# Altium schematic sheet QueenB-Schematic.SchDoc: QueenB
size A1; DrawnBy: PHIL SALMONY; Revision: A; SheetNumber: 1; SheetTotal: 1
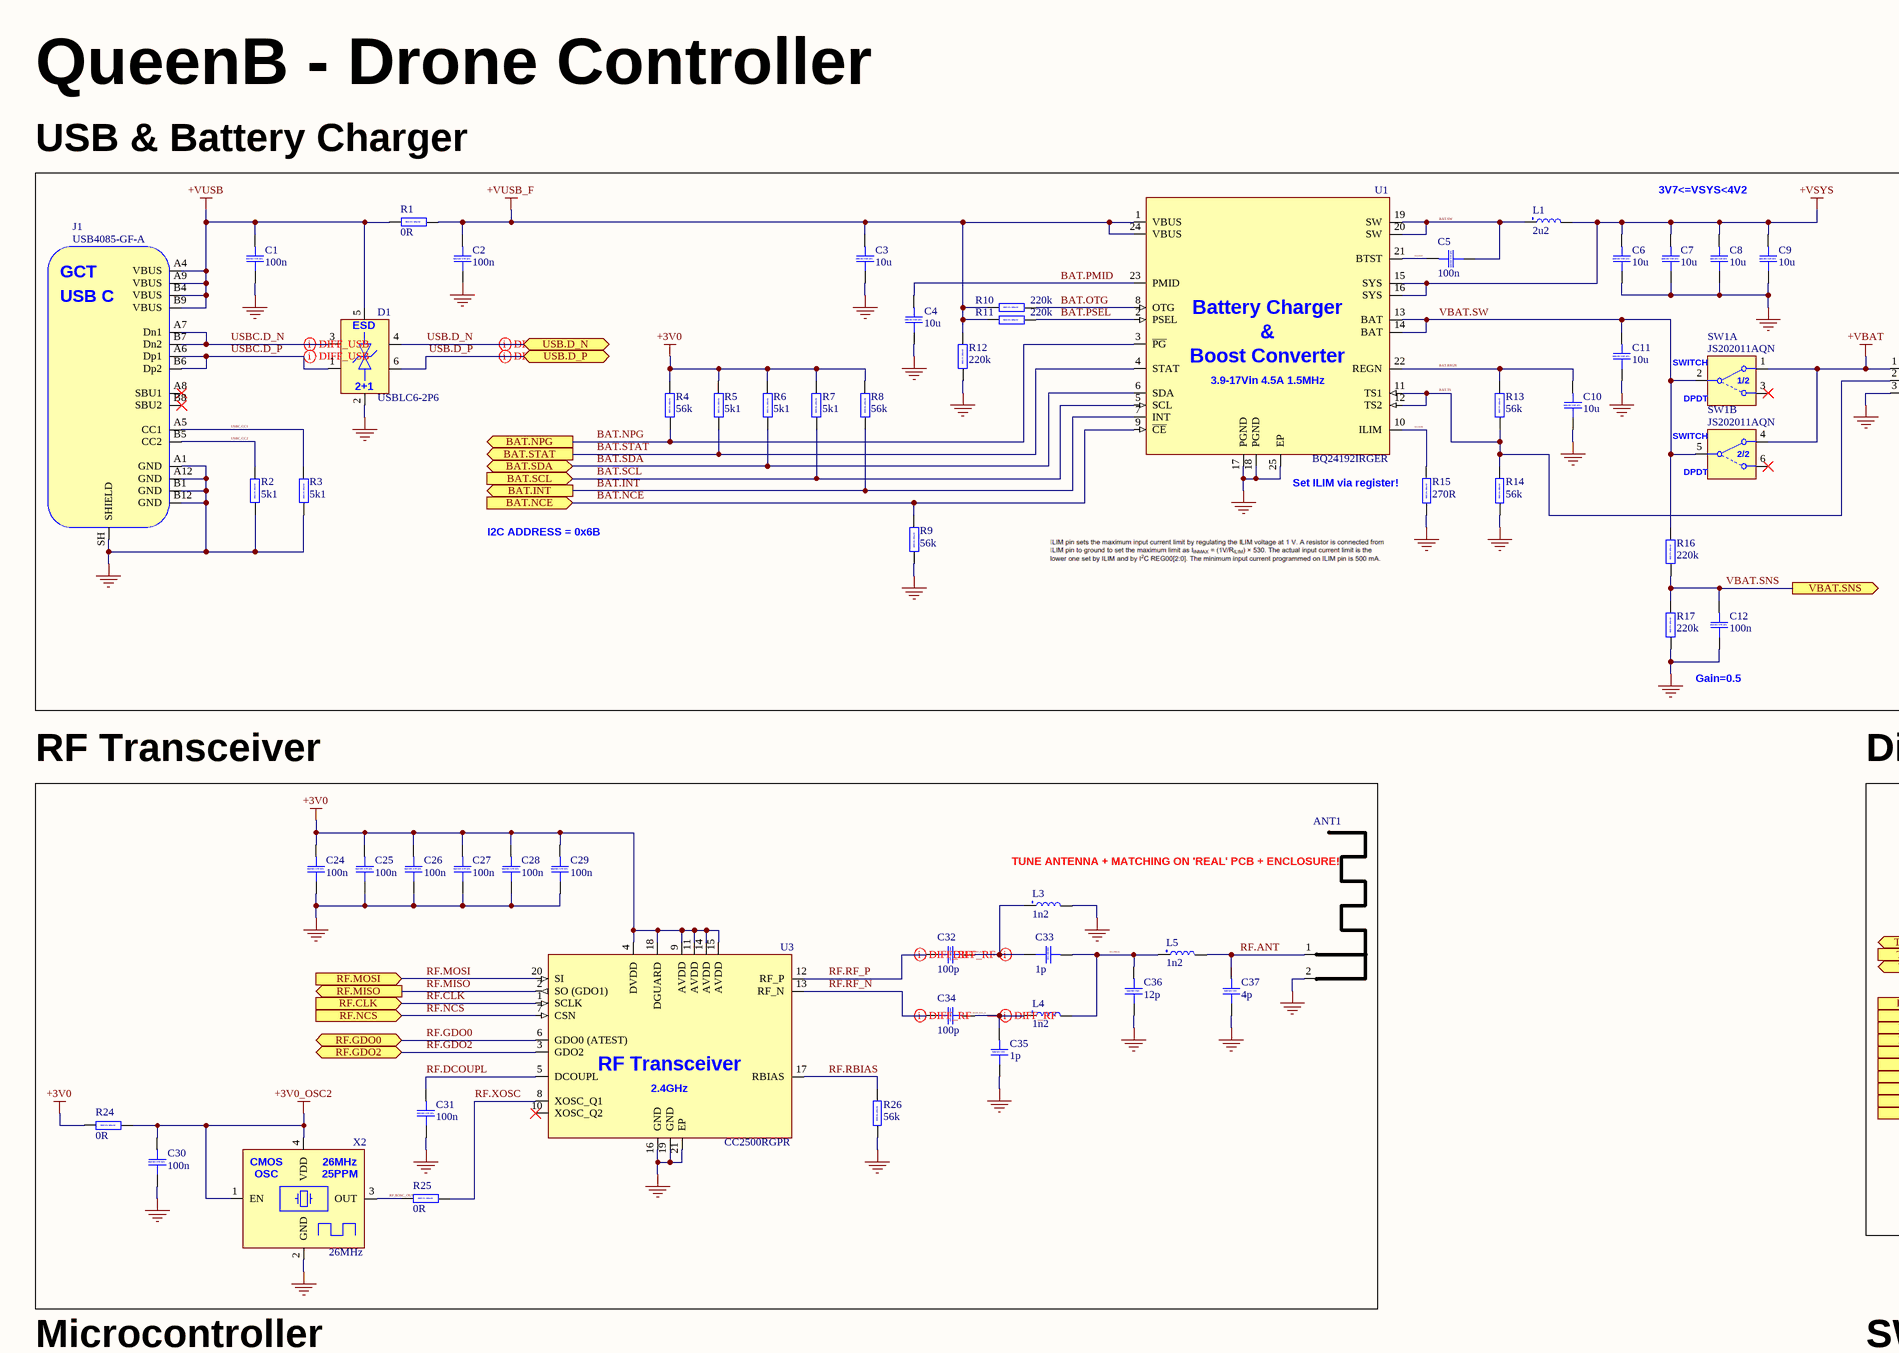
[diagram p0: QueenB-Schematic.SchDoc, top left]
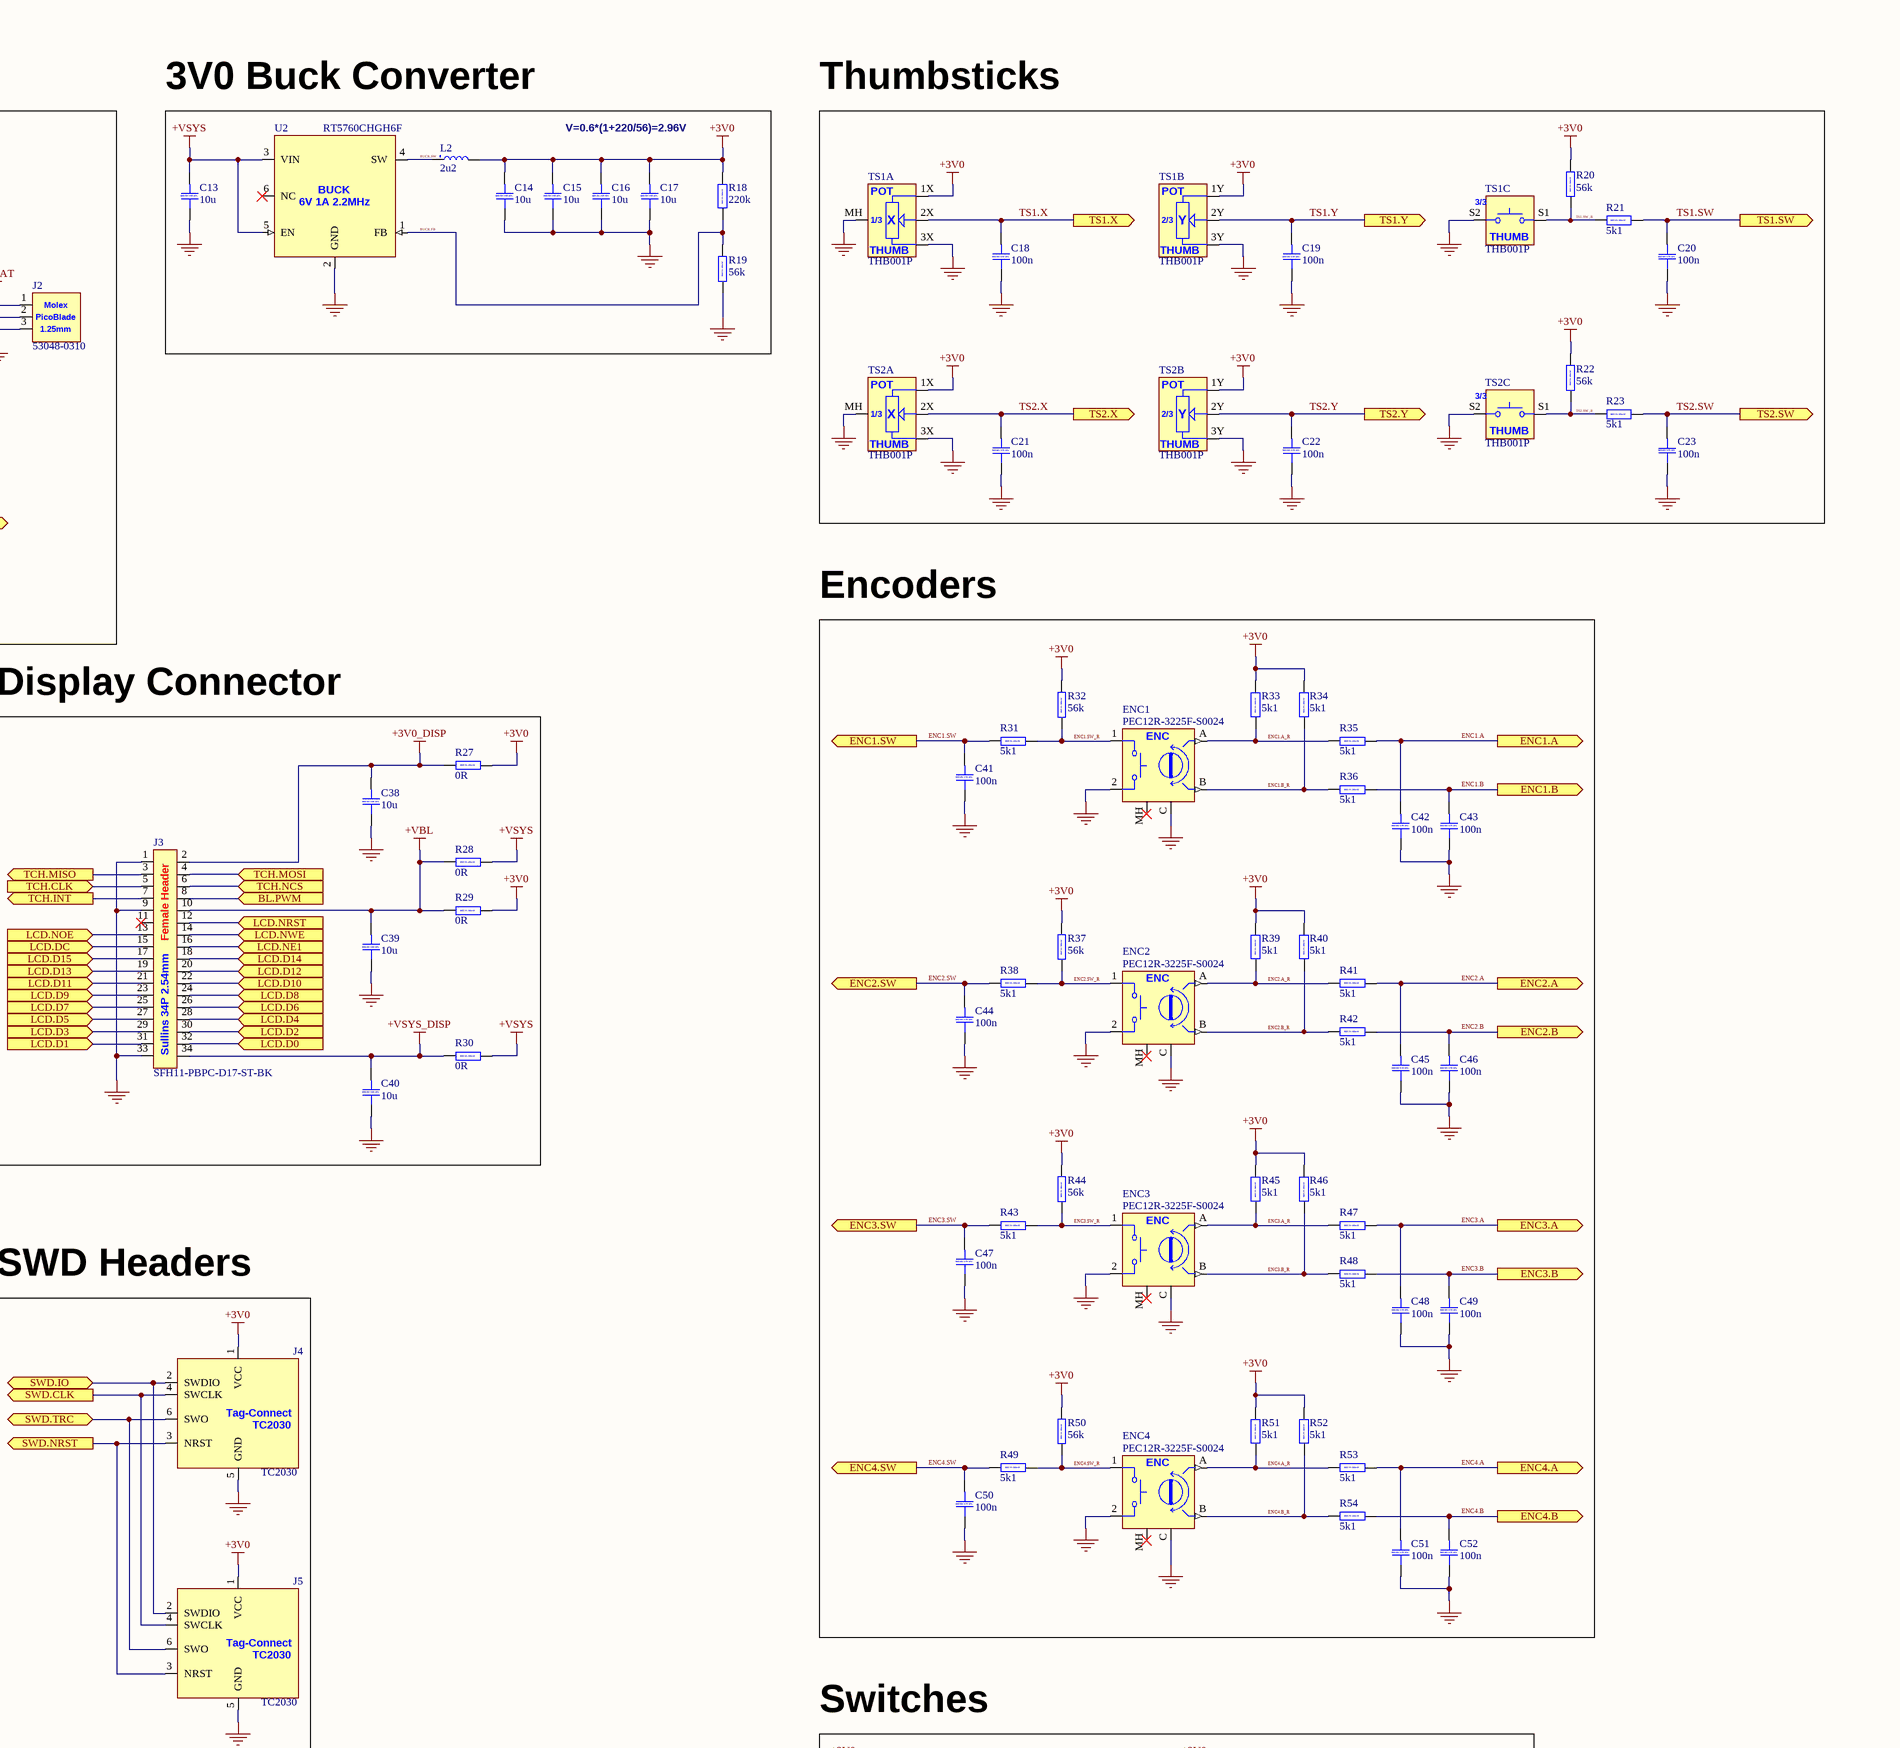
[diagram p1: QueenB-Schematic.SchDoc, top right]
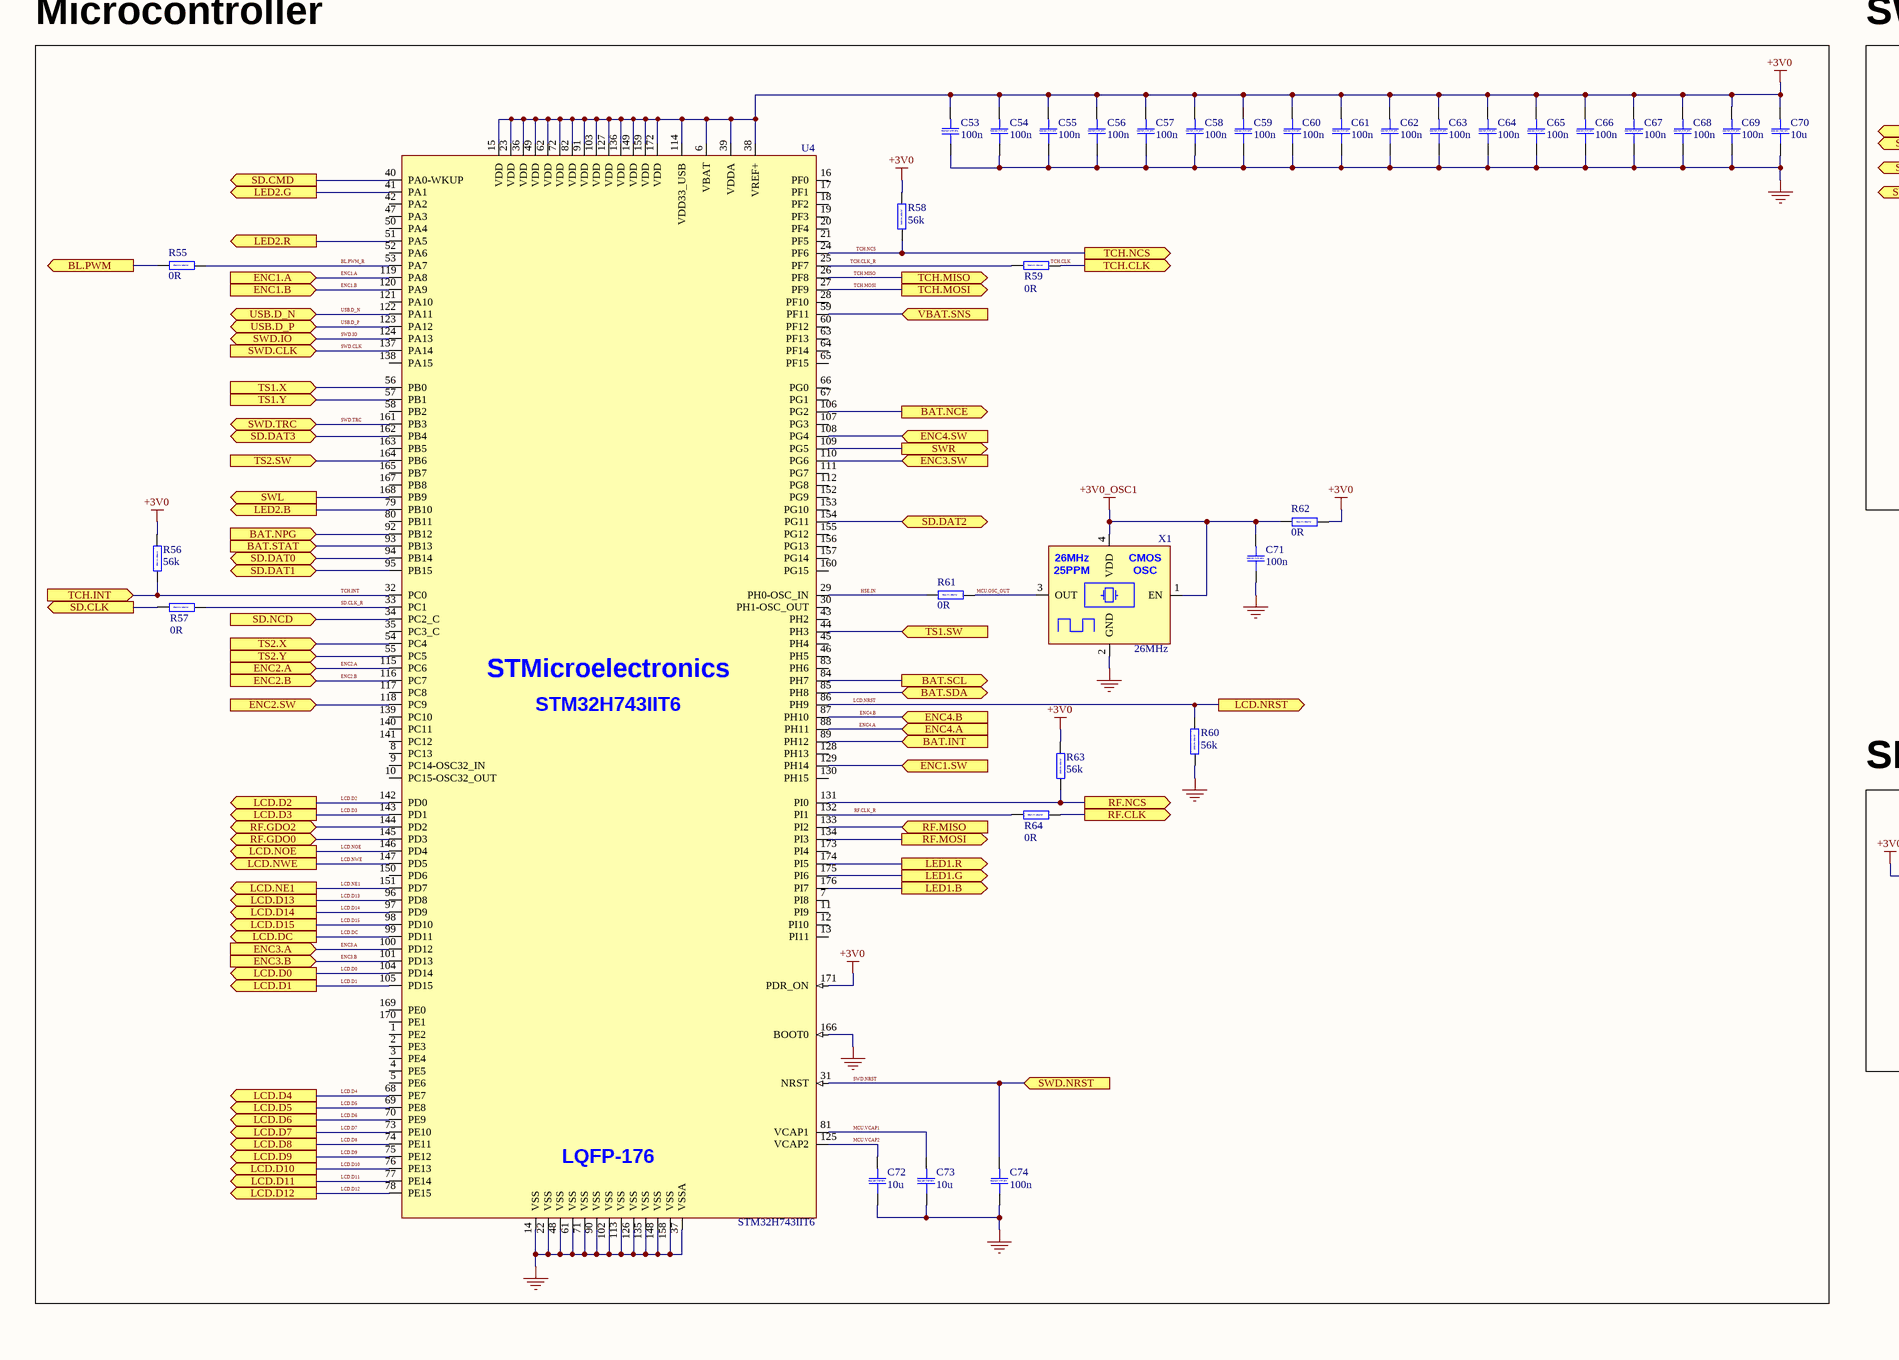
[diagram p2: QueenB-Schematic.SchDoc, bottom left]
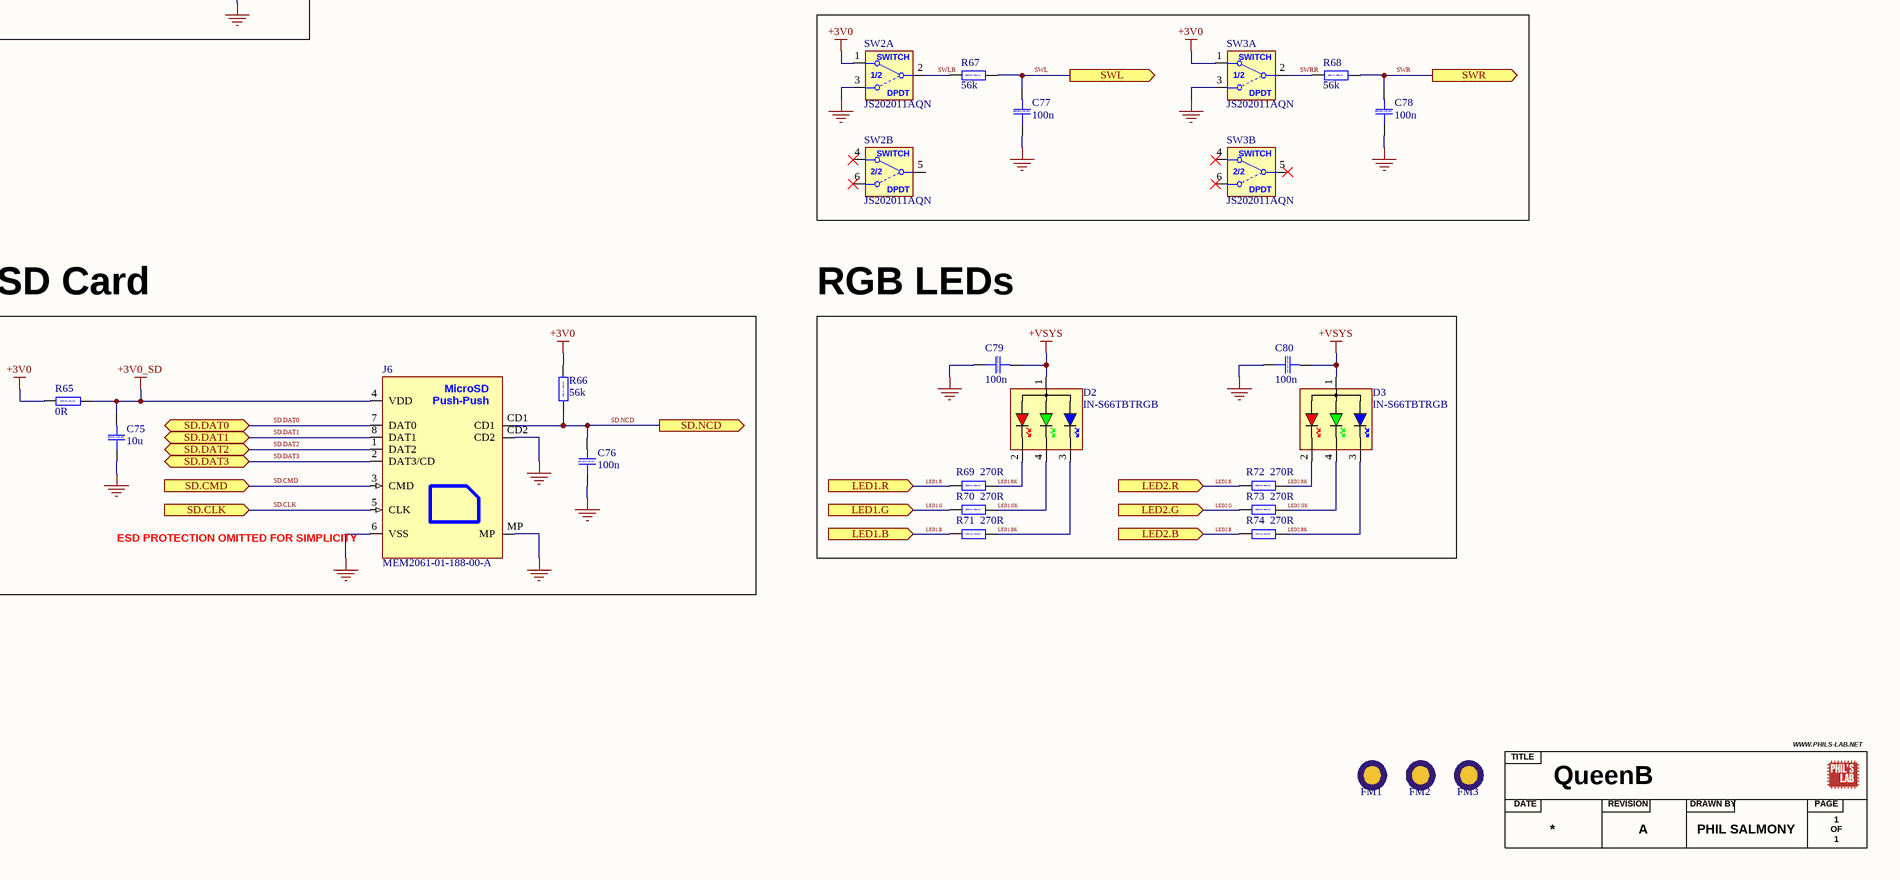
[diagram p3: QueenB-Schematic.SchDoc, bottom right]

## Parts
ANT1  PCB Antenna 2.4GHz 50Ohm  [ANT_IFA_USB_2_4GHZ_50R]  (value not drawn)  (no BOM)
C1  100n  [CAP_0603]
C2  100n  [CAP_0603]
C3  10u  [CAP_0805]
C4  10u  [CAP_0805]
C5  100n  [CAP_0603]
C6  10u  [CAP_0805]
C7  10u  [CAP_0805]
C8  10u  [CAP_0805]
C9  10u  [CAP_0805]
C10  10u  [CAP_0805]
C11  10u  [CAP_0805]
C12  100n  [CAP_0603]
C13  10u  [CAP_0805]
C14  10u  [CAP_0805]
C15  10u  [CAP_0805]
C16  10u  [CAP_0805]
C17  10u  [CAP_0805]
C18  100n  [CAP_0603]
C19  100n  [CAP_0603]
C20  100n  [CAP_0603]
C21  100n  [CAP_0603]
C22  100n  [CAP_0603]
C23  100n  [CAP_0603]
C24  100n  [CAP_0603]
C25  100n  [CAP_0603]
C26  100n  [CAP_0603]
C27  100n  [CAP_0603]
C28  100n  [CAP_0603]
C29  100n  [CAP_0603]
C30  100n  [CAP_0603]
C31  100n  [CAP_0603]
C32  100p  [CAP_0402]
C33  1p  [CAP_0402]
C34  100p  [CAP_0402]
C35  1p  [CAP_0402]
C36  12p  [CAP_0402]
C37  4p  [CAP_0402]
C38  10u  [CAP_0805]
C39  10u  [CAP_0805]
C40  10u  [CAP_0805]
C41  100n  [CAP_0603]
C42  100n  [CAP_0603]
C43  100n  [CAP_0603]
C44  100n  [CAP_0603]
C45  100n  [CAP_0603]
C46  100n  [CAP_0603]
C47  100n  [CAP_0603]
C48  100n  [CAP_0603]
C49  100n  [CAP_0603]
C50  100n  [CAP_0603]
C51  100n  [CAP_0603]
C52  100n  [CAP_0603]
C53  100n  [CAP_0603]
C54  100n  [CAP_0603]
C55  100n  [CAP_0603]
C56  100n  [CAP_0603]
C57  100n  [CAP_0603]
C58  100n  [CAP_0603]
C59  100n  [CAP_0603]
C60  100n  [CAP_0603]
C61  100n  [CAP_0603]
C62  100n  [CAP_0603]
C63  100n  [CAP_0603]
C64  100n  [CAP_0603]
C65  100n  [CAP_0603]
C66  100n  [CAP_0603]
C67  100n  [CAP_0603]
C68  100n  [CAP_0603]
C69  100n  [CAP_0603]
C70  10u  [CAP_0805]
C71  100n  [CAP_0603]
C72  10u  [CAP_0603]
C73  10u  [CAP_0603]
C74  100n  [CAP_0603]
C75  10u  [CAP_0805]
C76  100n  [CAP_0603]
C77  100n  [CAP_0603]
C78  100n  [CAP_0603]
C79  100n  [CAP_0603]
C80  100n  [CAP_0603]
D1  USBLC6-2P6  [SOT-666]
D2  IN-S66TBTRGB  [IN-S66TBTRGB]
D3  IN-S66TBTRGB  [IN-S66TBTRGB]
ENC1  PEC12R-3225F-S0024  [PEC12R-3225F-S]
ENC2  PEC12R-3225F-S0024  [PEC12R-3225F-S]
ENC3  PEC12R-3225F-S0024  [PEC12R-3225F-S]
ENC4  PEC12R-3225F-S0024  [PEC12R-3225F-S]
FM1  Fiducial Marker Round 1mm  [FIDUCIAL_MARKER_ROUND_1MM]  (value not drawn)  (no BOM)
FM2  Fiducial Marker Round 1mm  [FIDUCIAL_MARKER_ROUND_1MM]  (value not drawn)  (no BOM)
FM3  Fiducial Marker Round 1mm  [FIDUCIAL_MARKER_ROUND_1MM]  (value not drawn)  (no BOM)
J1  USB4085-GF-A  [USB4085-GF-A]
J2  53048-0310  [53048-0310]
J3  SFH11-PBPC-D17-ST-BK  [SFH11-PBPC-D17-ST-BK]
J4  TC2030  [TC2030]  (no BOM)
J5  TC2030  [TC2030]  (no BOM)
J6  MEM2061-01-188-00-A  [MEM2061-01-188-00-A]
L1  2u2  [XAL4020]
L2  2u2  [XAL4020]
L3  1n2  [IND_0402]
L4  1n2  [IND_0402]
L5  1n2  [IND_0402]
R1  0R  [RES_0603]
R2  5k1  [RES_0603]
R3  5k1  [RES_0603]
R4  56k  [RES_0603]
R5  5k1  [RES_0603]
R6  5k1  [RES_0603]
R7  5k1  [RES_0603]
R8  56k  [RES_0603]
R9  56k  [RES_0603]
R10  220k  [RES_0603]
R11  220k  [RES_0603]
R12  220k  [RES_0603]
R13  56k  [RES_0603]
R14  56k  [RES_0603]
R15  270R  [RES_0603]
R16  220k  [RES_0603]
R17  220k  [RES_0603]
R18  220k  [RES_0603]
R19  56k  [RES_0603]
R20  56k  [RES_0603]
R21  5k1  [RES_0603]
R22  56k  [RES_0603]
R23  5k1  [RES_0603]
R24  0R  [RES_0603]
R25  0R  [RES_0603]
R26  56k  [RES_0603]
R27  0R  [RES_0603]
R28  0R  [RES_0603]
R29  0R  [RES_0603]
R30  0R  [RES_0603]
R31  5k1  [RES_0603]
R32  56k  [RES_0603]
R33  5k1  [RES_0603]
R34  5k1  [RES_0603]
R35  5k1  [RES_0603]
R36  5k1  [RES_0603]
R37  56k  [RES_0603]
R38  5k1  [RES_0603]
R39  5k1  [RES_0603]
R40  5k1  [RES_0603]
R41  5k1  [RES_0603]
R42  5k1  [RES_0603]
R43  5k1  [RES_0603]
R44  56k  [RES_0603]
R45  5k1  [RES_0603]
R46  5k1  [RES_0603]
R47  5k1  [RES_0603]
R48  5k1  [RES_0603]
R49  5k1  [RES_0603]
R50  56k  [RES_0603]
R51  5k1  [RES_0603]
R52  5k1  [RES_0603]
R53  5k1  [RES_0603]
R54  5k1  [RES_0603]
R55  0R  [RES_0603]
R56  56k  [RES_0603]
R57  0R  [RES_0603]
R58  56k  [RES_0603]
R59  0R  [RES_0603]
R60  56k  [RES_0603]
R61  0R  [RES_0603]
R62  0R  [RES_0603]
R63  56k  [RES_0603]
R64  0R  [RES_0603]
R65  0R  [RES_0603]
R66  56k  [RES_0603]
R67  56k  [RES_0603]
R68  56k  [RES_0603]
R69  270R  [RES_0603]
R70  270R  [RES_0603]
R71  270R  [RES_0603]
R72  270R  [RES_0603]
R73  270R  [RES_0603]
R74  270R  [RES_0603]
SW1  JS202011AQN  [JS202011AQN]  (parts A,B of 2)
SW2  JS202011AQN  [JS202011AQN]  (parts A,B of 2)
SW3  JS202011AQN  [JS202011AQN]  (parts A,B of 2)
TB  Schematic Title Block Template  (value not drawn)  (graphical)
TS1  THB001P  [THB001P]  (parts A,B,C of 3)
TS2  THB001P  [THB001P]  (parts A,B,C of 3)
U1  BQ24192IRGER  [VQFN-24]
U2  RT5760CHGH6F  [SOT-563]
U3  CC2500RGPR  [QFN-20]
U4  STM32H743IIT6  [LQFP-176]
X1  26MHz  [XTAL_2520]
X2  26MHz  [XTAL_2520]

## Blocks framed on the sheet
USB & Battery Charger: C1-C12 D1 J1 J2 L1 R1-R17 SW1 U1
3V0 Buck Converter: C13-C17 L2 R18 R19 U2
Thumbsticks: C18-C23 R20-R23 TS1 TS2
Encoders: C41-C52 ENC1-ENC4 R31-R54
RF Transceiver: ANT1 C24-C37 L3-L5 R24-R26 U3 X2
Display Connector: C38-C40 J3 R27-R30
Microcontroller: C53-C74 R55-R64 U4 X1
SWD Headers: J4 J5
Switches: C77 C78 R67 R68 SW2 SW3
SD Card: C75 C76 J6 R65 R66
RGB LEDs: C79 C80 D2 D3 R69-R74

## Ports
BAT.INT (in, see QueenB-Schematic[2A]), BAT.INT (out, see QueenB-Schematic[3D]), BAT.NCE (in, see QueenB-Schematic[3C]), BAT.NCE (out, see QueenB-Schematic[2A]), BAT.NPG (in, see QueenB-Schematic[2A]), BAT.NPG (out, see QueenB-Schematic[1C]), BAT.SCL (in, see QueenB-Schematic[3C]), BAT.SCL (out, see QueenB-Schematic[2A]), BAT.SDA (bidir, see QueenB-Schematic[2A]), BAT.SDA (bidir, see QueenB-Schematic[3D]), BAT.STAT (in, see QueenB-Schematic[2A]), BAT.STAT (out, see QueenB-Schematic[1C]), BL.PWM (in, see QueenB-Schematic[1C]), BL.PWM (out, see QueenB-Schematic[7B]), ENC1.A (in, see QueenB-Schematic[11B]), ENC1.A (out, see QueenB-Schematic[1C]), ENC1.B (in, see QueenB-Schematic[11B]), ENC1.B (out, see QueenB-Schematic[1C]), ENC1.SW (in, see QueenB-Schematic[9B]), ENC1.SW (out, see QueenB-Schematic[3D]), ENC2.A (in, see QueenB-Schematic[11B]), ENC2.A (out, see QueenB-Schematic[1C]), ENC2.B (in, see QueenB-Schematic[11B]), ENC2.B (out, see QueenB-Schematic[1C]), ENC2.SW (in, see QueenB-Schematic[9B]), ENC2.SW (out, see QueenB-Schematic[1D]), ENC3.A (in, see QueenB-Schematic[11B]), ENC3.A (out, see QueenB-Schematic[1D]), ENC3.B (in, see QueenB-Schematic[11C]), ENC3.B (out, see QueenB-Schematic[1D]), ENC3.SW (in, see QueenB-Schematic[9B]), ENC3.SW (out, see QueenB-Schematic[3C]), ENC4.A (in, see QueenB-Schematic[11C]), ENC4.A (out, see QueenB-Schematic[3D]), ENC4.B (in, see QueenB-Schematic[11C]), ENC4.B (out, see QueenB-Schematic[3D]), ENC4.SW (in, see QueenB-Schematic[9C]), ENC4.SW (out, see QueenB-Schematic[3C]), LCD.D0 (in, see QueenB-Schematic[1D]), LCD.D0 (out, see QueenB-Schematic[7B]), LCD.D1 (in, see QueenB-Schematic[1D]), LCD.D1 (out, see QueenB-Schematic[7B]), LCD.D2 (in, see QueenB-Schematic[1D]), LCD.D2 (out, see QueenB-Schematic[7B]), LCD.D3 (in, see QueenB-Schematic[1D]), LCD.D3 (out, see QueenB-Schematic[7B]), LCD.D4 (in, see QueenB-Schematic[1D]), LCD.D4 (out, see QueenB-Schematic[7B]), LCD.D5 (in, see QueenB-Schematic[1D]), LCD.D5 (out, see QueenB-Schematic[7B]), LCD.D6 (in, see QueenB-Schematic[1D]), LCD.D6 (out, see QueenB-Schematic[7B]), LCD.D7 (in, see QueenB-Schematic[1D]), LCD.D7 (out, see QueenB-Schematic[7B]), LCD.D8 (in, see QueenB-Schematic[1D]), LCD.D8 (out, see QueenB-Schematic[7B]), LCD.D9 (in, see QueenB-Schematic[1D]), LCD.D9 (out, see QueenB-Schematic[7B]), LCD.D10 (in, see QueenB-Schematic[1D]), LCD.D10 (out, see QueenB-Schematic[7B]), LCD.D11 (in, see QueenB-Schematic[1D]), LCD.D11 (out, see QueenB-Schematic[7B]), LCD.D12 (in, see QueenB-Schematic[1D]), LCD.D12 (out, see QueenB-Schematic[7B]), LCD.D13 (in, see QueenB-Schematic[1D]), LCD.D13 (out, see QueenB-Schematic[7B]), LCD.D14 (in, see QueenB-Schematic[1D]), LCD.D14 (out, see QueenB-Schematic[7B]), LCD.D15 (in, see QueenB-Schematic[1D]), LCD.D15 (out, see QueenB-Schematic[7B]), LCD.DC (in, see QueenB-Schematic[1D]), LCD.DC (out, see QueenB-Schematic[7B]), LCD.NE1 (in, see QueenB-Schematic[1D]), LCD.NE1 (out, see QueenB-Schematic[7B]), LCD.NOE (in, see QueenB-Schematic[1D]), LCD.NOE (out, see QueenB-Schematic[7B]), LCD.NRST (in, see QueenB-Schematic[4D]), LCD.NRST (out, see QueenB-Schematic[7B]), LCD.NWE (in, see QueenB-Schematic[1D]), LCD.NWE (out, see QueenB-Schematic[7B]), LED1.B (in, see QueenB-Schematic[3D]), LED1.B (out, see QueenB-Schematic[9D]), LED1.G (in, see QueenB-Schematic[3D]), LED1.G (out, see QueenB-Schematic[9D]), LED1.R (in, see QueenB-Schematic[3D]), LED1.R (out, see QueenB-Schematic[9D]), LED2.B (in, see QueenB-Schematic[1C]), LED2.B (out, see QueenB-Schematic[10D]), LED2.G (in, see QueenB-Schematic[1C]), LED2.G (out, see QueenB-Schematic[10D]), LED2.R (in, see QueenB-Schematic[1C]), LED2.R (out, see QueenB-Schematic[10D]), RF.CLK (in, see QueenB-Schematic[4D]), RF.CLK (out, see QueenB-Schematic[2B]), RF.GDO0 (bidir, see QueenB-Schematic[1D]), RF.GDO0 (bidir, see QueenB-Schematic[2B]), RF.GDO2 (bidir, see QueenB-Schematic[1D]), RF.GDO2 (bidir, see QueenB-Schematic[2B]), RF.MISO (in, see QueenB-Schematic[2B]), RF.MISO (out, see QueenB-Schematic[3D]), RF.MOSI (in, see QueenB-Schematic[3D]), RF.MOSI (out, see QueenB-Schematic[2B]), RF.NCS (in, see QueenB-Schematic[4D]), RF.NCS (out, see QueenB-Schematic[2B]), SD.CLK (in, see QueenB-Schematic[1C]), SD.CLK (out, see QueenB-Schematic[7D]), SD.CMD (in, see QueenB-Schematic[1C]), SD.CMD (out, see QueenB-Schematic[7D]), SD.DAT0 (bidir, see QueenB-Schematic[1C]), SD.DAT0 (bidir, see QueenB-Schematic[7D]), SD.DAT1 (bidir, see QueenB-Schematic[1C]), SD.DAT1 (bidir, see QueenB-Schematic[7D]), SD.DAT2 (bidir, see QueenB-Schematic[3C]), SD.DAT2 (bidir, see QueenB-Schematic[7D]), SD.DAT3 (bidir, see QueenB-Schematic[1C]), SD.DAT3 (bidir, see QueenB-Schematic[7D]), SD.NCD (in, see QueenB-Schematic[9D]), SD.NCD (out, see QueenB-Schematic[1C]), SWD.CLK (in, see QueenB-Schematic[7C]), SWD.CLK (out, see QueenB-Schematic[1C]), SWD.IO (bidir, see QueenB-Schematic[1C]), SWD.IO (bidir, see QueenB-Schematic[7C]), SWD.NRST (in, see QueenB-Schematic[7C]), SWD.NRST (out, see QueenB-Schematic[4D]), SWD.TRC (bidir, see QueenB-Schematic[1C]), SWD.TRC (bidir, see QueenB-Schematic[7C]), SWL (out, see QueenB-Schematic[1C]), SWL (out, see QueenB-Schematic[10C]), SWR (out, see QueenB-Schematic[3C]), SWR (out, see QueenB-Schematic[11C]), TCH.CLK (in, see QueenB-Schematic[4C]), TCH.CLK (out, see QueenB-Schematic[7B]), TCH.INT (in, see QueenB-Schematic[7B]), TCH.INT (out, see QueenB-Schematic[1C]), TCH.MISO (out, see QueenB-Schematic[3C]), TCH.MISO (out, see QueenB-Schematic[7B]), TCH.MOSI (in, see QueenB-Schematic[3C]), TCH.MOSI (out, see QueenB-Schematic[7B]), TCH.NCS (in, see QueenB-Schematic[4C]), TCH.NCS (out, see QueenB-Schematic[7B]), TS1.SW (in, see QueenB-Schematic[12A]), TS1.SW (out, see QueenB-Schematic[3C]), TS1.X (in, see QueenB-Schematic[10A]), TS1.X (out, see QueenB-Schematic[1C]), TS1.Y (in, see QueenB-Schematic[11A]), TS1.Y (out, see QueenB-Schematic[1C]), TS2.SW (in, see QueenB-Schematic[12A]), TS2.SW (out, see QueenB-Schematic[1C]), TS2.X (in, see QueenB-Schematic[10A]), TS2.X (out, see QueenB-Schematic[1C]), TS2.Y (in, see QueenB-Schematic[11A]), TS2.Y (out, see QueenB-Schematic[1C]), USB.D_N (bidir, see QueenB-Schematic[1C]), USB.D_N (bidir, see QueenB-Schematic[2A]), USB.D_P (bidir, see QueenB-Schematic[1C]), USB.D_P (bidir, see QueenB-Schematic[2A]), VBAT.SNS (in, see QueenB-Schematic[6A]), VBAT.SNS (out, see QueenB-Schematic[3C])

## Nets
+3V0: C14.1 C15.1 C16.1 C17.1 C24.1 C25.1 C26.1 C27.1 C28.1 C29.1 C53.1 C54.1 C55.1 C56.1 C57.1 C58.1 C59.1 C60.1 C61.1 C62.1 C63.1 C64.1 C65.1 C66.1 C67.1 C68.1 C69.1 C70.1 J4.1(VCC) J5.1(VCC) L2.2 R4.2 R5.2 R6.2 R7.2 R8.2 R18.2 R20.2 R22.2 R24.1 R27.2 R29.2 R32.2 R33.2 R34.2 R37.2 R39.2 R40.2 R44.2 R45.2 R46.2 R50.2 R51.2 R52.2 R56.2 R58.2 R62.2 R63.2 R65.1 R66.2 SW2.1 SW3.1 TS1.1X TS1.1Y TS2.1X TS2.1Y U3.4(DVDD) U3.9(AVDD) U3.11(AVDD) U3.14(AVDD) U3.15(AVDD) U3.18(DGUARD) U4.6(VBAT) U4.15(VDD) U4.23(VDD) U4.36(VDD) U4.38(VREF+) U4.39(VDDA) U4.49(VDD) U4.62(VDD) U4.72(VDD) U4.82(VDD) U4.91(VDD) U4.103(VDD) U4.114(VDD33_USB) U4.127(VDD) U4.136(VDD) U4.149(VDD) U4.159(VDD) U4.171(PDR_ON) U4.172(VDD)
+3V0_DISP: C38.1 J3.2 R27.1
+3V0_OSC1: C71.1 R62.1 X1.1(EN) X1.4(VDD)
+3V0_OSC2: C30.1 R24.2 X2.1(EN) X2.4(VDD)
+3V0_SD: C75.1 J6.4(VDD) R65.2
+VBAT: J2.1 SW1.1 SW1.4
+VBL: C39.1 J3.10 R28.1 R29.1
+VSYS: C6.1 C7.1 C8.1 C9.1 C13.1 C79.1 C80.1 D2.1(CA) D3.1(CA) L1.2 R28.2 R30.2 U1.15(SYS) U1.16(SYS) U2.3(VIN) U2.5(EN)
+VSYS_DISP: C40.1 J3.34 R30.1
+VUSB: C1.1 D1.5(VBUS) J1.A4(VBUS) J1.A9(VBUS) J1.B4(VBUS) J1.B9(VBUS) R1.1
+VUSB_F: C2.1 C3.1 R1.2 R10.1 R11.1 R12.2 U1.1(VBUS) U1.24(VBUS)
GND: ANT1.2(GND) C1.2 C2.2 C3.2 C4.2 C6.2 C7.2 C8.2 C9.2 C10.2 C11.2 C12.2 C13.2 C14.2 C15.2 C16.2 C17.2 C18.2 C19.2 C20.2 C21.2 C22.2 C23.2 C24.2 C25.2 C26.2 C27.2 C28.2 C29.2 C30.2 C31.2 C35.2 C36.2 C37.2 C38.2 C39.2 C40.2 C41.2 C42.2 C43.2 C44.2 C45.2 C46.2 C47.2 C48.2 C49.2 C50.2 C51.2 C52.2 C53.2 C54.2 C55.2 C56.2 C57.2 C58.2 C59.2 C60.2 C61.2 C62.2 C63.2 C64.2 C65.2 C66.2 C67.2 C68.2 C69.2 C70.2 C71.2 C72.2 C73.2 C74.2 C75.2 C76.2 C77.2 C78.2 C79.2 C80.2 D1.2(GND) ENC1.2 ENC1.C(GND) ENC2.2 ENC2.C(GND) ENC3.2 ENC3.C(GND) ENC4.2 ENC4.C(GND) J1.A1(GND) J1.A12(GND) J1.B1(GND) J1.B12(GND) J1.SH(SHIELD) J2.3 J3.1 J3.9 J3.33 J4.5(GND) J5.5(GND) J6.6(VSS) J6.CD2 J6.MP L3.2 R2.1 R3.1 R9.1 R12.1 R14.1 R15.1 R17.1 R19.1 R26.1 R60.1 SW2.3 SW3.3 TS1.3X TS1.3Y TS1.MH TS1.S2 TS2.3X TS2.3Y TS2.MH TS2.S2 U1.17(PGND) U1.18(PGND) U1.25(EP) U2.2(GND) U3.16(GND) U3.19(GND) U3.21(EP) U4.14(VSS) U4.22(VSS) U4.37(VSSA) U4.48(VSS) U4.61(VSS) U4.71(VSS) U4.90(VSS) U4.102(VSS) U4.113(VSS) U4.126(VSS) U4.135(VSS) U4.148(VSS) U4.158(VSS) U4.166(BOOT0) X1.2(GND) X2.2(GND)
BAT.BST: C5.1 U1.21(BTST)
BAT.ILIM: R15.2 U1.10(ILIM)
BAT.INT: R8.1 U1.7(INT) U4.89(PH12) ; port BAT.INT
BAT.NCE: R9.2 U1.9(~{CE}) U4.106(PG2) ; port BAT.NCE
BAT.NPG: R4.1 U1.3(~{PG}) U4.92(PB12) ; port BAT.NPG
BAT.OTG: R10.2 U1.8(OTG)
BAT.PMID: C4.1 U1.23(PMID)
BAT.PSEL: R11.2 U1.2(PSEL)
BAT.REGN: C10.1 R13.2 U1.22(REGN)
BAT.SCL: R7.1 U1.5(SCL) U4.84(PH7) ; port BAT.SCL
BAT.SDA: R6.1 U1.6(SDA) U4.85(PH8) ; port BAT.SDA
BAT.STAT: R5.1 U1.4(STAT) U4.93(PB13) ; port BAT.STAT
BAT.SW: C5.2 L1.1 U1.19(SW) U1.20(SW)
BAT.TS: J2.2 R13.1 R14.2 U1.11(TS1) U1.12(TS2)
BL.PWM: J3.8 R55.1 ; port BL.PWM
BL.PWM_R: R55.2 U4.53(PA7)
BUCK.FB: R18.1 R19.2 U2.1(FB)
BUCK.SW: L2.1 U2.4(SW)
ENC1.A: C42.1 R35.2 U4.119(PA8) ; port ENC1.A
ENC1.A_R: ENC1.A R33.1 R35.1
ENC1.B: C43.1 R36.2 U4.120(PA9) ; port ENC1.B
ENC1.B_R: ENC1.B R34.1 R36.1
ENC1.SW: C41.1 R31.1 U4.129(PH14) ; port ENC1.SW
ENC1.SW_R: ENC1.1 R31.2 R32.1
ENC2.A: C45.1 R41.2 U4.115(PC6) ; port ENC2.A
ENC2.A_R: ENC2.A R39.1 R41.1
ENC2.B: C46.1 R42.2 U4.116(PC7) ; port ENC2.B
ENC2.B_R: ENC2.B R40.1 R42.1
ENC2.SW: C44.1 R38.1 U4.118(PC9) ; port ENC2.SW
ENC2.SW_R: ENC2.1 R37.1 R38.2
ENC3.A: C48.1 R47.2 U4.100(PD12) ; port ENC3.A
ENC3.A_R: ENC3.A R45.1 R47.1
ENC3.B: C49.1 R48.2 U4.101(PD13) ; port ENC3.B
ENC3.B_R: ENC3.B R46.1 R48.1
ENC3.SW: C47.1 R43.1 U4.110(PG6) ; port ENC3.SW
ENC3.SW_R: ENC3.1 R43.2 R44.1
ENC4.A: C51.1 R53.2 U4.88(PH11) ; port ENC4.A
ENC4.A_R: ENC4.A R51.1 R53.1
ENC4.B: C52.1 R54.2 U4.87(PH10) ; port ENC4.B
ENC4.B_R: ENC4.B R52.1 R54.1
ENC4.SW: C50.1 R49.1 U4.108(PG4) ; port ENC4.SW
ENC4.SW_R: ENC4.1 R49.2 R50.1
HSE.IN: R61.1 U4.29(PH0-OSC_IN)
LCD.D0: J3.32 U4.104(PD14) ; port LCD.D0
LCD.D1: J3.31 U4.105(PD15) ; port LCD.D1
LCD.D2: J3.30 U4.142(PD0) ; port LCD.D2
LCD.D3: J3.29 U4.143(PD1) ; port LCD.D3
LCD.D4: J3.28 U4.68(PE7) ; port LCD.D4
LCD.D5: J3.27 U4.69(PE8) ; port LCD.D5
LCD.D6: J3.26 U4.70(PE9) ; port LCD.D6
LCD.D7: J3.25 U4.73(PE10) ; port LCD.D7
LCD.D8: J3.24 U4.74(PE11) ; port LCD.D8
LCD.D9: J3.23 U4.75(PE12) ; port LCD.D9
LCD.D10: J3.22 U4.76(PE13) ; port LCD.D10
LCD.D11: J3.21 U4.77(PE14) ; port LCD.D11
LCD.D12: J3.20 U4.78(PE15) ; port LCD.D12
LCD.D13: J3.19 U4.96(PD8) ; port LCD.D13
LCD.D14: J3.18 U4.97(PD9) ; port LCD.D14
LCD.D15: J3.17 U4.98(PD10) ; port LCD.D15
LCD.DC: J3.15 U4.99(PD11) ; port LCD.DC
LCD.NE1: J3.16 U4.151(PD7) ; port LCD.NE1
LCD.NOE: J3.13 U4.146(PD4) ; port LCD.NOE
LCD.NRST: J3.12 R60.2 U4.86(PH9) ; port LCD.NRST
LCD.NWE: J3.14 U4.147(PD5) ; port LCD.NWE
LED1.B: R71.2 U4.176(PI7) ; port LED1.B
LED1.BK: D2.3(KB) R71.1
LED1.G: R70.2 U4.175(PI6) ; port LED1.G
LED1.GK: D2.4(KG) R70.1
LED1.R: R69.2 U4.174(PI5) ; port LED1.R
LED1.RK: D2.2(KR) R69.1
LED2.B: R74.2 U4.79(PB10) ; port LED2.B
LED2.BK: D3.3(KB) R74.1
LED2.G: R73.2 U4.41(PA1) ; port LED2.G
LED2.GK: D3.4(KG) R73.1
LED2.R: R72.2 U4.51(PA5) ; port LED2.R
LED2.RK: D3.2(KR) R72.1
MCU.OSC_OUT: R61.2 X1.3(OUT)
MCU.VCAP1: C73.1 U4.81(VCAP1)
MCU.VCAP2: C72.1 U4.125(VCAP2)
RF.ANT: ANT1.1(RF) C37.1 L5.2
RF.CLK: R64.2 U3.1(SCLK) ; port RF.CLK
RF.CLK_R: R64.1 U4.132(PI1)
RF.DCOUPL: C31.1 U3.5(DCOUPL)
RF.GDO0: U3.6(GDO0_(ATEST)) U4.145(PD3) ; port RF.GDO0
RF.GDO2: U3.3(GDO2) U4.144(PD2) ; port RF.GDO2
RF.MISO: U3.2(SO_(GDO1)) U4.133(PI2) ; port RF.MISO
RF.MOSI: U3.20(SI) U4.134(PI3) ; port RF.MOSI
RF.NCS: R63.1 U3.7(CSN) U4.131(PI0) ; port RF.NCS
RF.RBIAS: R26.2 U3.17(RBIAS)
RF.RF_BAL_N: C34.1 C35.1 L4.1
RF.RF_BAL_P: C32.1 C33.2 L3.1
RF.RF_N: C34.2 U3.13(RF_N)
RF.RF_P: C32.2 U3.12(RF_P)
RF.UNBAL: C33.1 C36.1 L4.2 L5.1
RF.XOSC: R25.2 U3.8(XOSC_Q1)
RF.XOSC_OUT: R25.1 X2.3(OUT)
SD.CLK: J6.5(CLK) R57.1 ; port SD.CLK
SD.CLK_R: R57.2 U4.33(PC1)
SD.CMD: J6.3(CMD) U4.40(PA0-WKUP) ; port SD.CMD
SD.DAT0: J6.7(DAT0) U4.94(PB14) ; port SD.DAT0
SD.DAT1: J6.8(DAT1) U4.95(PB15) ; port SD.DAT1
SD.DAT2: J6.1(DAT2) U4.154(PG11) ; port SD.DAT2
SD.DAT3: J6.2(DAT3/CD) U4.162(PB4) ; port SD.DAT3
SD.NCD: C76.1 J6.CD1 R66.1 U4.34(PC2_C) ; port SD.NCD
SWD.CLK: J4.4(SWCLK) J5.4(SWCLK) U4.137(PA14) ; port SWD.CLK
SWD.IO: J4.2(SWDIO) J5.2(SWDIO) U4.124(PA13) ; port SWD.IO
SWD.NRST: C74.1 J4.3(NRST) J5.3(NRST) U4.31(NRST) ; port SWD.NRST
SWD.TRC: J4.6(SWO) J5.6(SWO) U4.161(PB3) ; port SWD.TRC
SWL: C77.1 R67.2 U4.168(PB9) ; port SWL
SWLR: R67.1 SW2.2
SWR: C78.1 R68.2 U4.109(PG5) ; port SWR
SWRR: R68.1 SW3.2
TCH.CLK: J3.5 R59.2 ; port TCH.CLK
TCH.CLK_R: R59.1 U4.25(PF7)
TCH.INT: J3.7 R56.1 U4.32(PC0) ; port TCH.INT
TCH.MISO: J3.3 U4.26(PF8) ; port TCH.MISO
TCH.MOSI: J3.4 U4.27(PF9) ; port TCH.MOSI
TCH.NCS: J3.6 R58.1 U4.24(PF6) ; port TCH.NCS
TS1.SW: C20.1 R21.1 U4.44(PH3) ; port TS1.SW
TS1.SW_R: R20.1 R21.2 TS1.S1
TS1.X: C18.1 TS1.2X U4.56(PB0) ; port TS1.X
TS1.Y: C19.1 TS1.2Y U4.57(PB1) ; port TS1.Y
TS2.SW: C23.1 R23.1 U4.164(PB6) ; port TS2.SW
TS2.SW_R: R22.1 R23.2 TS2.S1
TS2.X: C21.1 TS2.2X U4.54(PC4) ; port TS2.X
TS2.Y: C22.1 TS2.2Y U4.55(PC5) ; port TS2.Y
USB.D_N: D1.4(IO1) U4.122(PA11) ; port USB.D_N
USB.D_P: D1.6(IO2) U4.123(PA12) ; port USB.D_P
USBC.CC1: J1.A5(CC1) R3.2
USBC.CC2: J1.B5(CC2) R2.2
USBC.D_N: D1.3(IO1) J1.A7(Dn1) J1.B7(Dn2)
USBC.D_P: D1.1(IO2) J1.A6(Dp1) J1.B6(Dp2)
VBAT.SNS: C12.1 R16.1 R17.2 U4.59(PF11) ; port VBAT.SNS
VBAT.SW: C11.1 R16.2 SW1.2 SW1.5 U1.13(BAT) U1.14(BAT)

Not connected (* = marked no-connect by the designer): ENC1 MH*; ENC2 MH*; ENC3 MH*; ENC4 MH*; J1 A8(SBU1)* B8(SBU2)*; J3 11*; SW1 3* 6*; SW2 4* 5 6*; SW3 4* 5* 6*; U2 6(NC)*; U3 10(XOSC_Q2)*; U4 1(PE2) 2(PE3) 3(PE4) 4(PE5) 5(PE6) 7(PI8) 8(PC13) 9(PC14-OSC32_IN) 10(PC15-OSC32_OUT) 11(PI9) 12(PI10) 13(PI11) 16(PF0) 17(PF1) 18(PF2) 19(PF3) 20(PF4) 21(PF5) 28(PF10) 30(PH1-OSC_OUT) 35(PC3_C) 42(PA2) 43(PH2) 45(PH4) 46(PH5) 47(PA3) 50(PA4) 52(PA6) 58(PB2) 60(PF12) 63(PF13) 64(PF14) 65(PF15) 66(PG0) 67(PG1) 80(PB11) 83(PH6) 107(PG3) 111(PG7) 112(PG8) 117(PC8) 121(PA10) 128(PH13) 130(PH15) 138(PA15) 139(PC10) 140(PC11) 141(PC12) 150(PD6) 152(PG9) 153(PG10) 155(PG12) 156(PG13) 157(PG14) 160(PG15) 163(PB5) 165(PB7) 167(PB8) 169(PE0) 170(PE1) 173(PI4)

## Layout directives
differential pair; differential pair class DIFF_RF: RF.RF_BAL_N, RF.RF_BAL_P, RF.RF_N, RF.RF_P
differential pair; differential pair class USB: USB.D_N, USB.D_P, USBC.D_N, USBC.D_P

## Notes on the sheet
- QueenB - Drone Controller
- 3V7<=VSYS<4V2
- V=0.6*(1+220/56)=2.96V
- (near R15) Set ILIM via register!
- I2C ADDRESS = 0x6B
- Gain=0.5
- (near L3) TUNE ANTENNA + MATCHING ON 'REAL' PCB + ENCLOSURE!
- ESD PROTECTION OMITTED FOR SIMPLICITY
- (in symbol 53048-0310) PicoBlade; 1.25mm
- (in symbol BQ24192IRGER) Battery Charger; &; Boost Converter; 3.9-17Vin 4.5A 1.5MHz
- (in symbol CC0603KRX7R9BB104) 0603 50V X7R 10%
- (in symbol CC0603MRX5R6BB106) 0603 10V X5R 20%
- (in symbol CC0805KKX5R8BB106) 0805 25V X5R 10%
- (in symbol CC2500RGPR) RF Transceiver; 2.4GHz
- (in symbol ECS-2520MVQ-260-CN-TR) CMOS; OSC; 25PPM
- (in symbol GRM1555C1H1R0CA01D) 0402 50V C0G
- (in symbol GRM1555C1H4R0CA01D) 0402 50V C0G
- (in symbol GRM1555C1H101FA01J) 0402 100V C0G
- (in symbol GRM1555C1H120GA01D) 0402 50V C0G
- (in symbol JS202011AQN, part A) SWITCH; 1/2; DPDT
- (in symbol JS202011AQN, part B) SWITCH; 2/2; DPDT
- (in symbol MEM2061-01-188-00-A) MicroSD; Push-Push
- (in symbol PEC12R-3225F-S0024) ENC
- (in symbol RC0603FR-070RL) 0603 1% 100mW
- (in symbol RC0603FR-075K1L) 0603 1% 100mW
- (in symbol RC0603FR-0756KL) 0603 1% 100mW
- (in symbol RC0603FR-07220KL) 0603 1% 100mW
- (in symbol RC0603FR-07270RL) 0603 1% 100mW
- (in symbol RT5760CHGH6F) BUCK; 6V 1A 2.2MHz
- (in symbol SCHEMATIC_TITLE_BLOCK) WWW.PHILS-LAB.NET; TITLE; DATE; REVISION; DRAWN BY; PAGE; OF
- (in symbol SFH11-PBPC-D17-ST-BK) Female Header; Sullins 34P 2.54mm
- (in symbol STM32H743IIT6) LQFP-176
- (in symbol THB001P, part A) POT; 1/3; X; THUMB
- (in symbol THB001P, part B) POT; 2/3; Y; THUMB
- (in symbol THB001P, part C) 3/3; THUMB
- (in symbol USB4085-GF-A) USB C
- (in symbol USBLC6-2P6) ESD; 2+1

## Library data of the parts
ANT1 = ANT_IFA_USB_2_4GHZ_50R: Inverted F 2.4GHz ISM PCB Antenna 50 Ohm; ComponentLink1Description: Datasheet; ComponentLink1URL: https://www.ti.com/lit/an/swra117d/swra117d.pdf
C1 C2 C5 C12 C18-C31 C41-C69 C71 C74 C76-C80 = CC0603KRX7R9BB104: Capacitor SMD 0603 X7R 50V 10% 100nF; Manufacturer: YAGEO; Manufacturer Part Number: CC0603KRX7R9BB104; Distributor Link 1: https://www.mouser.com/ProductDetail/YAGEO/CC0603KRX7R9BB104?qs=vTakOoo5QyLvVCYM2ge8LQ%3D%3D; Distributor Link 2: https://www.digikey.com/en/products/detail/yageo/CC0603KRX7R9BB104/2103082?s=N4IgTCBcDaIMJwAwDZEGYDSAlAGgdiwE4AhYgRkQBYQBdAXyA; LCSC: C14663; Dielectric: X7R; Voltage Rating: 50V; Tolerance: 10%; Mounting Type: SMD; Package: 0603; ComponentLink1Description: Datasheet; ComponentLink1URL: https://www.mouser.com/datasheet/2/447/UPY_GPHC_X7R_6_3V_to_250V_23-3084653.pdf; Value: 100nF; Supplier 1: Digi-Key; Supplier Part Number 1: 311-1344-1-ND; Supplier 2: Mouser; Supplier Part Number 2: 603-CC603KRX7R9BB104
C3 C4 C6-C11 C13-C17 C38-C40 C70 C75 = CC0805KKX5R8BB106: Capacitor SMD 0805 X5R 25V 10% 10uF; Manufacturer: YAGEO; Manufacturer Part Number: CC0805KKX5R8BB106; Distributor Link 1: https://www.mouser.com/ProductDetail/YAGEO/CC0805KKX5R8BB106?qs=57cj7OiSijm89pM64t1AGQ%3D%3D; Distributor Link 2: https://www.digikey.com/en/products/detail/yageo/CC0805KKX5R8BB106/5195275?s=N4IgTCBcDaIMJwAwA5EFYDSGAaaBKyAQoQIyIBsIAugL5A; LCSC: C89831; Dielectric: X5R; Voltage Rating: 25V; Tolerance: 10%; Mounting Type: SMD; Package: 0805; ComponentLink1Description: Datasheet; ComponentLink1URL: https://www.mouser.com/datasheet/2/447/UPY_NP0X5R_01005_4V_to_25V_V10-3003057.pdf; Value: 10u; Supplier 1: Digi-Key; Supplier Part Number 1: 311-1869-1-ND; Supplier 2: Mouser; Supplier Part Number 2: 603-CC805KKX5R8BB106
C32 C34 = GRM1555C1H101FA01J: Capacitor SMD 0402 C0G 100V 1% 100pF; Manufacturer: Murata; Manufacturer Part Number: GRM1555C1H101FA01J; Distributor Link 1: https://www.mouser.com/ProductDetail/Murata-Electronics/GRM1555C1H101FA01J?qs=ouTquLLW2S5iwhfDVY6IbQ%3D%3D; Distributor Link 2: https://www.digikey.com/en/products/detail/murata-electronics/GRM1555C1H101FA01J/4358141?s=N4IgTCBcDaIOICUCyBGArBgwigEigDCgGICChAUiALoC%2BQA; LCSC: C3885782; Dielectric: C0G; Voltage Rating: 100V; Tolerance: 1%; Mounting Type: SMD; Package: 0402; ComponentLink1Description: Datasheet; ComponentLink1URL: https://www.mouser.com/datasheet/2/281/1/GRM1555C1H101FA01_01A-1982636.pdf; Value: 100pF; Supplier 1: Mouser; Supplier Part Number 1: 81-GRM1555C1H101FA1J; Supplier 2: Digikey; Supplier Part Number 2: 490-7753-1-ND
C33 C35 = GRM1555C1H1R0CA01D: Capacitor SMD 0402 C0G 50V +-0.25pF 1pF; Manufacturer: Murata; Tolerance: 0.25pF; Manufacturer Part Number: GRM1555C1H1R0CA01D; Distributor Link 1: https://www.mouser.com/ProductDetail/Murata-Electronics/GRM1555C1H1R0CA01D?qs=%2F%252BPMR94VuMa25lWmdXJ42A%3D%3D; Distributor Link 2: https://www.digikey.com/en/products/detail/murata-electronics/GRM1555C1H1R0CA01D/702465?s=N4IgTCBcDaIOICUCyBGArBgwigEihADJgIIEoAiIAugL5A; LCSC: C76953; Dielectric: C0G; Voltage Rating: 50V; Mounting Type: SMD; Package: 0402; ComponentLink1Description: Datasheet; ComponentLink1URL: https://www.mouser.com/datasheet/2/281/1/GRM1555C1H1R0CA01_01A-1982679.pdf; Value: 1pF; Supplier 1: Mouser; Supplier Part Number 1: 81-GRM1555C1H1R0CA1D; Supplier 2: Digikey; Supplier Part Number 2: 490-3199-1-ND
C36 = GRM1555C1H120GA01D: Capacitor SMD 0402 C0G 50V 2% 12pF; Manufacturer: Murata; Manufacturer Part Number: GRM1555C1H120GA01D; Distributor Link 1: https://www.mouser.com/ProductDetail/Murata-Electronics/GRM1555C1H120GA01D?qs=ouTquLLW2S70TfGSrj0CAA%3D%3D; Distributor Link 2: https://www.digikey.com/en/products/detail/murata-electronics/GRM1555C1H120GA01D/3693923?s=N4IgTCBcDaIOICUCyBGArBgwigEisADHAIIEoAiIAugL5A; LCSC: C161527; Dielectric: C0G; Voltage Rating: 50V; Tolerance: 2%; Mounting Type: SMD; Package: 0402; ComponentLink1Description: Datasheet; ComponentLink1URL: https://www.mouser.com/datasheet/2/281/1/GRM1555C1H1R0CA01_01A-1982679.pdf; Value: 12pF; Supplier 1: Mouser; Supplier Part Number 1: 81-GRM1555C1H120GA1D; Supplier 2: Digikey; Supplier Part Number 2: 490-6197-1-ND
C37 = GRM1555C1H4R0CA01D: Capacitor SMD 0402 C0G 50V +-0.25pF 4pF; Manufacturer: Murata; Tolerance: 0.25pF; Manufacturer Part Number: GRM1555C1H4R0CA01D; Distributor Link 1: https://www.mouser.com/ProductDetail/Murata-Electronics/GRM1555C1H4R0CA01D?qs=ouTquLLW2S5cT3MALCOVGw%3D%3D; Distributor Link 2: https://www.digikey.com/en/products/detail/murata-electronics/GRM1555C1H4R0CA01D/3175192?s=N4IgTCBcDaIOICUCyBGArBgwigEgFgQAZMBBQlAERAF0BfIA; Dielectric: C0G; Voltage Rating: 50V; Mounting Type: SMD; Package: 0402; ComponentLink1Description: Datasheet; ComponentLink1URL: https://www.mouser.com/datasheet/2/281/1/GRM1555C1H1R0CA01_01A-1982679.pdf; Value: 4pF; Supplier 1: Mouser; Supplier Part Number 1: 81-GRM1555C1H4R0CA1D; Supplier 2: Digikey; Supplier Part Number 2: 490-5873-1-ND
C72 C73 = CC0603MRX5R6BB106: Capacitor SMD 0603 X5R 10V 20% 10uF; Manufacturer: YAGEO; Manufacturer Part Number: CC0603MRX5R6BB106; Distributor Link 1: https://www.mouser.com/ProductDetail/YAGEO/CC0603MRX5R6BB106?qs=57cj7OiSijmAyiZFow0XAw%3D%3D; Distributor Link 2: https://www.digikey.com/en/products/detail/yageo/CC0603MRX5R6BB106/5195224?s=N4IgTCBcDaIMJwAwDZEGYCyAlAGgVi2QCEiBGFEAXQF8g; LCSC: C109453; Dielectric: X5R; Voltage Rating: 10V; Tolerance: 20%; Mounting Type: SMD; Package: 0603; ComponentLink1Description: Datasheet; ComponentLink1URL: https://www.mouser.com/datasheet/2/447/UPY_NP0X5R_01005_4V_to_25V_V10-3003057.pdf; Value: 10uF; Supplier 1: Digikey; Supplier Part Number 1: 311-1817-1-ND; Supplier 2: Mouser; Supplier Part Number 2: 603-CC603MRX5R6BB106
D1 = USBLC6-2P6: ESD Protection TVS Diodes Unidirectional USB 3-Channel 5.25V 6V 17V 4pF; Manufacturer: STMicroelectronics; ESD Rating: 15kV; Peak Pulse Current: 5A; Manufacturer Part Number: USBLC6-2P6; Distributor Link 1: https://www.mouser.com/ProductDetail/STMicroelectronics/USBLC6-2P6?qs=6ARB0lp6jlViGcbUSvj1Mw%3D%3D; Distributor Link 2: https://www.digikey.com/en/products/detail/stmicroelectronics/USBLC6-2P6/1007440?s=N4IgTCBcDaIKoGUBCAZAwgNgLRgAoZAF0BfIA; LCSC: C15999; Mounting Type: SMD; Breakdown Voltage: 6V; Clamping Voltage: 17V; Working Voltage: 5.25V; Polarity: Unidirectional; Capacitance: 4pF; ComponentLink1Description: Datasheet; ComponentLink1URL: https://www.mouser.com/datasheet/2/389/cd00050750-1796222.pdf; Supplier 1: Mouser; Supplier Part Number 1: 511-USBLC6-2P6; Supplier 2: Digikey; Supplier Part Number 2: 497-5026-1-ND
D2 D3 = IN-S66TBTRGB: RGB LED Common Anode; Manufacturer: Inolux; Manufacturer Part Number: IN-S66TBTRGB; Distributor Link 1: https://www.mouser.com/ProductDetail/Inolux/IN-S66TBTRGB?qs=fAHHVMwC%252BbiOVqMqnf3yig%3D%3D; Distributor Link 2: https://www.digikey.com/en/products/detail/inolux/IN-S66TBTRGB/7604944?s=N4IgTCBcDaIJIDkC0BlAbGgKgIUwJQHFsQBdAXyA; ComponentLink1Description: Datasheet; ComponentLink1URL: https://www.mouser.com/datasheet/2/180/IN-S66TBTRGB_V1.0-1488301.pdf; Mounting Type: SMD; LCSC: C6968979; Supplier 1: Digikey; Supplier Part Number 1: 1830-1076-1-ND; Supplier 2: Mouser; Supplier Part Number 2: 743-IN-S66TBTRGB
ENC1-ENC4 = PEC12R-3225F-S0024: Rotary Encoder TH Vertical Switch 24 Detents 25mm Threaded Shaft; Manufacturer: Bourns; Switch: Yes; Detents: 24; Shaft Diameter: 6mm; Manufacturer Part Number: PEC12R-3225F-S0024; Distributor Link 1: https://www.mouser.com/ProductDetail/Bourns/PEC12R-3225F-S0024?qs=%252B9%2Fcbd0IE0RkGCm1rUs7CA%3D%3D; Distributor Link 2: https://www.digikey.com/en/products/detail/bourns-inc/pec12r-3225f-s0024/4699267; Mounting Type: TH; Mounting Orientation: Vertical; Supplier 1: Digi-Key; Supplier Part Number 1: PEC12R-3225F-S0024-ND; Supplier 2: Cytech Systems; Supplier Part Number 2: PEC12R-3225F-S0024; ComponentLink1Description: Datasheet; ComponentLink1URL: https://www.mouser.com/datasheet/2/54/PEC12R-777795.pdf; LCSC: C7541212
FM1-FM3 = FM_ROUND_1MM: Fiducial Marker Round 1mm (No BoM, Mechanical)
J1 = USB4085-GF-A: USB Connector Type-C TH Right-Angle 12 Pin; Manufacturer: GCT; Manufacturer Part Number: USB4105-GF-A-060; Distributor Link 1: https://www.mouser.com/ProductDetail/GCT/USB4085-GF-A?qs=KUoIvG%2F9Ilba1bQOahfWjw%3D%3D; Distributor Link 2: https://www.digikey.com/en/products/detail/gct/USB4105-GF-A-060/14559036?s=N4IgTCBcDaIKoGUBCAWAjABgKwFoDiAYjgII4YBsGIAugL5A; Mounting Type: TH; ComponentLink1Description: Datasheet; ComponentLink1URL: https://www.mouser.com/datasheet/2/837/Global_Connector_Technology_usb4105-3106202.pdf; Supplier 1: Farnell; Supplier Part Number 1: 2924867; Supplier 2: Newark; Supplier Part Number 2: 74AC2281; LCSC: C9900013983
J2 = 53048-0310: PicoBlade Connector Wire-to-Board Through-Hole Right-Angle 1.25mm Pitch 3 Positions; Manufacturer: Molex; Manufacturer Part Number: 53048-0310; Distributor Link 1: https://www.mouser.com/ProductDetail/Molex/53048-0310?qs=zXrbR4Jv0OfUlEeVnlaifA%3D%3D; Distributor Link 2: https://www.digikey.com/en/products/detail/molex/0530480310/242865?s=N4IgTCBcDaIKwGYAMAWAHAWiQgjEkAugL5A; Mounting Type: TH; ComponentLink1Description: Datasheet; ComponentLink1URL: https://www.molex.com/content/dam/molex/molex-dot-com/products/automated/en-us/salesdrawingpdf/530/53048/530480310_sd.pdf?inline; LCSC: C505275; Supplier 1: Mouser; Supplier Part Number 1: 538-53048-0310; Supplier 2: Digikey; Supplier Part Number 2: WM1743-ND
J3 = SFH11-PBPC-D17-ST-BK: Board-to-Board Connector Header TH 2.54mm Pitch Vertical Female 2 Rows 34 Positions; Manufacturer: Sullins; Manufacturer Part Number: SFH11-PBPC-D17-ST-BK; Distributor Link 1: https://www.digikey.com/en/products/detail/sullins-connector-solutions/SFH11-PBPC-D17-ST-BK/1990092; Distributor Link 2: https://www.lcsc.com/product-detail/Female-Headers_Sullins-Connector-Solutions-SFH11-PBPC-D17-ST-BK_C3321225.html; ComponentLink1Description: Datasheet; ComponentLink1URL: https://www.lcsc.com/datasheet/lcsc_datasheet_2404031658_Sullins-Connector-Solutions-SFH11-PBPC-D17-ST-BK_C3321225.pdf; Mounting Type: TH; LCSC: C3321225; Supplier 1: Digikey; Supplier Part Number 1: S9199-ND; Supplier 2: Future Electronics; Supplier Part Number 2: 5009023
J4 J5 = TC2030: Tag-Connect 2030 No-Solder With Legs SWD Debug Connector DO NOT PLACE NO BOM; Manufacturer: Tag-Connect; Manufacturer Part Number: TC2030
J6 = MEM2061-01-188-00-A: MicroSD Card Connector Push-Push SMD; Manufacturer: GCT; Manufacturer Part Number: MEM2061-01-188-00-A; Distributor Link 1: https://www.mouser.com/ProductDetail/GCT/MEM2061-01-188-00-A?qs=KUoIvG%2F9IlYc25USp0M1eQ%3D%3D; Distributor Link 2: https://www.digikey.com/en/products/detail/gct/MEM2061-01-188-00-A/9859612?s=N4IgTCBcDaILIFE5gAwDYCMBaF2MA58cUsBBEAXQF8g; Mounting Type: SMD; ComponentLink1Description: Datasheet; ComponentLink1URL: https://www.mouser.com/datasheet/2/837/MEM2061-2887869.pdf; Supplier 1: Digikey; Supplier Part Number 1: 2073-MEM2061-01-188-00-ACT-ND; Supplier 2: Mouser; Supplier Part Number 2: 640-MEM20610118800A; LCSC: C5151738
L1 L2 = XAL4020-222MEC: Inductor SMD 1616 Shielded 2.2uH 5.5A 5.6A 39mΩ 20%; Manufacturer: Coilcraft; Manufacturer Part Number: XAL4020-222MEC; Distributor Link 1: https://www.mouser.com/ProductDetail/Coilcraft/XAL4020-222MEC?qs=zCSbvcPd3pbr7vuk%252B2nqkg%3D%3D; LCSC: C3151182; Package: 1616; Mounting Type: SMD; DC Current Rating: 5.5A; DC Resistance: 39mΩ; Tolerance: 20%; Value: 2.2uH; Distributor Link 2: https://www.digikey.com/en/products/detail/coilcraft/XAL4020-222MEC/21380860?s=N4IgTCBcDaIBoEEAyAWADGNBaMuCyAogMIgC6AvkA; ComponentLink1Description: Datasheet; ComponentLink1URL: https://www.mouser.com/datasheet/2/597/xal4000-270751.pdf; Supplier 1: Farnell; Supplier Part Number 1: 2289054; Supplier 2: Mouser; Supplier Part Number 2: 994-XAL4020-222MEC
L3-L5 = LQG15HS1N2S02D: Inductor SMD 0402 RF Unshielded 1.2nH 1A 70mΩ +-0.3nH; Manufacturer: Murata; Tolerance: 0.3nH; Manufacturer Part Number: LQG15HS1N2S02D; Distributor Link 1: https://www.mouser.com/ProductDetail/Murata-Electronics/LQG15HS1N2S02D?qs=ctz47l0uL1D0KdbucxjbqA%3D%3D; Package: 0402; Mounting Type: SMD; DC Current Rating: 1A; DC Resistance: 70mΩ; Value: 1.2nH; Distributor Link 2: https://www.digikey.com/en/products/detail/murata-electronics/LQG15HS1N2S02D/662860?s=N4IgTCBcDaIDIEUDiBGArACQMooHJiwAYwAREAXQF8g; ComponentLink1Description: Datasheet; ComponentLink1URL: https://www.mouser.com/datasheet/2/281/1/JELF243B_0010-1699614.pdf; LCSC: C77105; Supplier 1: Mouser; Supplier Part Number 1: 81-LQG15HS1N2S02D; Supplier 2: Digikey; Supplier Part Number 2: 490-2611-1-ND
R1 R24 R25 R27-R30 R55 R57 R59 R61 R62 R64 R65 = RC0603FR-070RL: Resistor SMD Thick Film 0603 75V 100mW 1% 0Ω; Manufacturer: YAGEO; Manufacturer Part Number: RC0603FR-070RL; Distributor Link 1: https://www.mouser.com/ProductDetail/YAGEO/RC0603FR-070RL?qs=0yPvnVz5%2FmpDQv43TwvCfw%3D%3D; LCSC: C100044; Package: 0603; Mounting Type: SMD; Voltage Rating: 75V; Power Rating: 100mW; Film: Thick; Tolerance: 1%; Value: 0Ω; Distributor Link 2: https://www.digikey.com/en/products/detail/yageo/RC0603FR-070RL/1304008?s=N4IgTCBcDaIEoGEAMA2JBmAYnAtEg7EnADIgC6AvkA; ComponentLink1Description: Datasheet; ComponentLink1URL: https://www.mouser.com/datasheet/2/447/YAGEO_PYu_RC_Group_51_RoHS_L_12-3313492.pdf; Supplier 1: Digi-Key; Supplier Part Number 1: 311-0.0HRCT-ND; Supplier 2: Mouser; Supplier Part Number 2: 603-RC0603FR-070RL
R2 R3 R5-R7 R21 R23 R31 R33-R36 R38-R43 R45-R49 R51-R54 = RC0603FR-075K1L: Resistor SMD Thick Film 0603 75V 100mW 1% 5.1kΩ; Manufacturer: YAGEO; Manufacturer Part Number: RC0603FR-075K1L; Distributor Link 1: https://www.mouser.com/ProductDetail/YAGEO/RC0603FR-075K1L?qs=sGAEpiMZZMukHu%252BjC5l7YfGIerj%2FLQjmNxxJv1i4hYs%3D; LCSC: C105580; Package: 0603; Mounting Type: SMD; Voltage Rating: 75V; Power Rating: 100mW; Film: Thick; Tolerance: 1%; Value: 5.1kΩ; Distributor Link 2: https://www.digikey.com/en/products/detail/yageo/rc0603fr-075k1l/727268; ComponentLink1Description: Datasheet; ComponentLink1URL: https://www.mouser.com/datasheet/2/447/YAGEO_PYu_RC_Group_51_RoHS_L_12-3313492.pdf; Supplier 1: Digi-Key; Supplier Part Number 1: 311-5.10KHRCT-ND; Supplier 2: Mouser; Supplier Part Number 2: 603-RC0603FR-075K1L
R4 R8 R9 R13 R14 R19 R20 R22 R26 R32 R37 R44 R50 R56 R58 R60 R63 R66-R68 = RC0603FR-0756KL: Resistor SMD Thick Film 0603 75V 100mW 1% 56kΩ; Manufacturer: YAGEO; Manufacturer Part Number: RC0603FR-0756KL; Distributor Link 1: https://www.mouser.com/ProductDetail/YAGEO/RC0603FR-0756KL?qs=gt6vzsuosg2TemPyt%2FVaqg%3D%3D; LCSC: C114630; Package: 0603; Mounting Type: SMD; Voltage Rating: 75V; Power Rating: 100mW; Film: Thick; Tolerance: 1%; Value: 56kΩ; Distributor Link 2: https://www.digikey.com/en/products/detail/yageo/RC0603FR-0756KL/2827626?s=N4IgTCBcDaIEoGEAMA2JBmAYnAtEg7AKwoDSAMiALoC%2BQA; ComponentLink1Description: Datasheet; ComponentLink1URL: https://www.mouser.com/datasheet/2/447/YAGEO_PYu_RC_Group_51_RoHS_L_12-3313492.pdf; Supplier 1: Digikey; Supplier Part Number 1: 311-56KHRCT-ND; Supplier 2: Mouser; Supplier Part Number 2: 603-RC0603FR-0756KL
R10-R12 R16-R18 = RC0603FR-07220KL: Resistor SMD Thick Film 0603 75V 100mW 1% 220kΩ; Manufacturer: YAGEO; Manufacturer Part Number: RC0603FR-07220KL; Distributor Link 1: https://www.mouser.com/ProductDetail/YAGEO/RC0603FR-07220KL?qs=nHyvTUT5UJ87BOKAmWeB9w%3D%3D; LCSC: C123420; Package: 0603; Mounting Type: SMD; Voltage Rating: 75V; Power Rating: 100mW; Film: Thick; Tolerance: 1%; Value: 220kΩ; Distributor Link 2: https://www.digikey.com/en/products/detail/yageo/RC0603FR-07220KL/727062?s=N4IgTCBcDaIEoGEAMA2JBmAYnAtEg7GGEgNIAyIAugL5A; ComponentLink1Description: Datasheet; ComponentLink1URL: https://www.mouser.com/datasheet/2/447/YAGEO_PYu_RC_Group_51_RoHS_L_12-3313492.pdf; Supplier 1: Digikey; Supplier Part Number 1: 311-220KHRCT-ND; Supplier 2: Mouser; Supplier Part Number 2: 603-RC0603FR-07220KL
R15 R69-R74 = RC0603FR-07270RL: Resistor SMD Thick Film 0603 75V 100mW 1% 270Ω; Manufacturer: YAGEO; Manufacturer Part Number: RC0603FR-07270RL; Distributor Link 1: https://www.mouser.com/ProductDetail/YAGEO/RC0603FR-07270RL?qs=diQw95jMAePl%252BPNr4oNP6Q%3D%3D; LCSC: C137754; Package: 0603; Mounting Type: SMD; Voltage Rating: 75V; Power Rating: 100mW; Film: Thick; Tolerance: 1%; Value: 270Ω; Distributor Link 2: https://www.digikey.com/en/products/detail/yageo/RC0603FR-07270RL/727103?s=N4IgTCBcDaIEoGEAMA2JBmAYnAtEg7GPknADIgC6AvkA; ComponentLink1Description: Datasheet; ComponentLink1URL: https://www.mouser.com/datasheet/2/447/YAGEO_PYu_RC_Group_51_RoHS_L_12-3313492.pdf; Supplier 1: Digi-Key; Supplier Part Number 1: 311-270HRCT-ND; Supplier 2: Mouser; Supplier Part Number 2: 603-RC0603FR-07270RL
SW1-SW3 = JS202011AQN: Slide Switch TH DPDT Horizontal; Manufacturer: C&K; Manufacturer Part Number: JS202011AQN; Distributor Link 1: https://www.mouser.com/ProductDetail/CK/JS202011AQN?qs=LgMIjt8LuD%252Bmsz6wAeWWtQ%3D%3D; Distributor Link 2: https://www.digikey.com/en/products/detail/c-k/JS202011AQN/1640096?s=N4IgTCBcDaIFIGUwAYUEY0EECKA5EAugL5A; Mounting Type: TH; ComponentLink1Description: Datasheet; ComponentLink1URL: https://www.mouser.com/datasheet/2/240/js-3050885.pdf; LCSC: C221662; Supplier 1: Digikey; Supplier Part Number 1: 401-2000-ND; Supplier 2: Mouser; Supplier Part Number 2: 611-JS202011AQN
TB = SCHEMATIC_TITLE_BLOCK: Schematic Title Block Template (Phil's Lab)
TS1 TS2 = THB001P: Thumbstick Miniature with Switch; Manufacturer: C&K Switches; Manufacturer Part Number: THB001P; Distributor Link 1: https://www.mouser.com/ProductDetail/CK/THB001P?qs=OlC7AqGiEDlMaVQ%2FEBrivA%3D%3D; Distributor Link 2: https://www.digikey.com/en/products/detail/c-k/THB001P/11687191; LCSC: C2685355; Mounting Type: SMD; ComponentLink1Description: Datasheet; ComponentLink1URL: https://www.mouser.com/datasheet/2/240/thb-3050713.pdf; Supplier 1: Digikey; Supplier Part Number 1: 108-THB001P-ND; Supplier 2: Mouser; Supplier Part Number 2: 611-THB001P
U1 = BQ24192IRGER: Battery Charger With Boost Converter I2C USB 3.9V-17V 4.5A 1.5MHz; Manufacturer: Texas Instruments; Manufacturer Part Number: BQ24192IRGER; Distributor Link 1: https://www.mouser.com/ProductDetail/Texas-Instruments/BQ24192IRGER?qs=E2%2FxqS9xjzr6wMOSrJegZQ%3D%3D&_gl=1*1ry5n32*_ga*dW5kZWZpbmVk*_ga_15W4STQT4T*MTcwODg1NjY3Ny40Ny4xLjE3MDg4NTY2OTcuNDAuMC4w*_ga_1KQLCYKRX3*MTcwODg1NjY3Ny40Ny4xLjE3MDg4NTY2OTcuMC4wLjA.; Distributor Link 2: https://www.digikey.com/en/products/detail/texas-instruments/BQ24192IRGER/3725784?s=N4IgTCBcDaIEIEUwBYCMBOMBJASgcQFEcQBdAXyA; Mounting Type: SMD; ComponentLink1Description: Datasheet; ComponentLink1URL: https://www.ti.com/lit/ds/symlink/bq24192.pdf?ts=1708776181838&ref_url=https%253A%252F%252Fwww.mouser.fr%252F; LCSC: C2861301; Supplier 1: Mouser; Supplier Part Number 1: 595-BQ24192IRGER; Supplier 2: Digikey; Supplier Part Number 2: 296-35053-1-ND
U2 = RT5760CHGH6F: Buck Converter Synchronous 2.5V-6V 1A 2.2MHz; Manufacturer: Richtek; Manufacturer Part Number: RT5760CHGH6F; Distributor Link 1: https://www.mouser.com/ProductDetail/Richtek/RT5760CHGH6F?qs=amGC7iS6iy%252BN%252B8HY%2Fsuiig%3D%3D; Distributor Link 2: https://www.digikey.com/en/products/detail/richtek-usa-inc/RT5760CHGH6F/13174410; ComponentLink1Description: Datasheet; ComponentLink1URL: https://www.richtek.com/assets/product_file/RT5760/DS5760-02.pdf; LCSC: C2976591; Mounting Type: SMD; Supplier 1: Digikey; Supplier Part Number 1: 1028-RT5760CHGH6FCT-ND; Supplier 2: Mouser; Supplier Part Number 2: 835-RT5760CHGH6F
U3 = CC2500RGPR: RF Transceiver 2.4GHz; Manufacturer: Texas Instruments; Manufacturer Part Number: CC2500RGPR; Distributor Link 1: https://www.mouser.com/ProductDetail/Texas-Instruments/CC2500RGPR?qs=fCaEr91xLHdZYq08V6GJXA%3D%3D; Distributor Link 2: https://www.digikey.com/en/products/detail/texas-instruments/CC2500RGPR/4695539?s=N4IgTCBcDaIMJzAVgAwoEoHEAK6QF0BfIA; Mounting Type: SMD; ComponentLink1Description: Datasheet; ComponentLink1URL: https://www.ti.com/lit/ds/symlink/cc2500.pdf?ts=1708688622620; LCSC: C57494; Supplier 1: Mouser; Supplier Part Number 1: 595-CC2500RGPR; Supplier 2: Digikey; Supplier Part Number 2: 296-38562-1-ND
U4 = STM32H743IIT6: ARM Cortex M7 32bit MCU 480MHz 2MB Flash 1MB RAM; Manufacturer: STMicroelectronics; Manufacturer Part Number: STM32H743IIT6; Distributor Link 1: https://www.mouser.com/ProductDetail/STMicroelectronics/STM32H743IIT6?qs=FNcb6ahWXRzE163cq8Rfjg%3D%3D; Distributor Link 2: https://www.digikey.com/en/products/detail/stmicroelectronics/STM32H743IIT6/7915904?s=N4IgTCBcDaIMoBUCyBmMAJA7AFhQSTwQDYQBdAXyA; Mounting Type: SMD; ComponentLink1Description: Datasheet; ComponentLink1URL: https://www.mouser.com/datasheet/2/389/stm32h743vi-1760857.pdf; LCSC: C89597; Supplier 1: Mouser; Supplier Part Number 1: 511-STM32H743IIT6; Supplier 2: Digi-Key; Supplier Part Number 2: 497-17722-ND
X1 X2 = ECS-2520MVQ-260-CN-TR: Crystal Oscillator SMD CMOS 26MHz 25ppm 15pF; Manufacturer: ECS; Manufacturer Part Number: ECS-2520MVQ-260-CN-TR; Distributor Link 1: https://www.mouser.com/ProductDetail/ECS/ECS-2520MVQ-260-CN-TR?qs=GedFDFLaBXEqI4jsvhzkaw%3D%3D; Distributor Link 2: https://www.digikey.com/en/products/detail/ecs-inc/ECS-2520MVQ-260-CN-TR/12088411?s=N4IgTCBcDaIKIGEDKBaMBWMAGAsgNQEU0A2LFBAORQBUAlEAXQF8g; ComponentLink1Description: Datasheet; ComponentLink1URL: https://www.mouser.com/datasheet/2/122/ECS_2520MVQ-1825379.pdf; Mounting Type: SMD; LCSC: C17351222; Supplier 1: Digikey; Supplier Part Number 1: 50-ECS-2520MVQ-260-CN-CT-ND; Supplier 2: Mouser; Supplier Part Number 2: 520-2520MVQ-260-CN-T